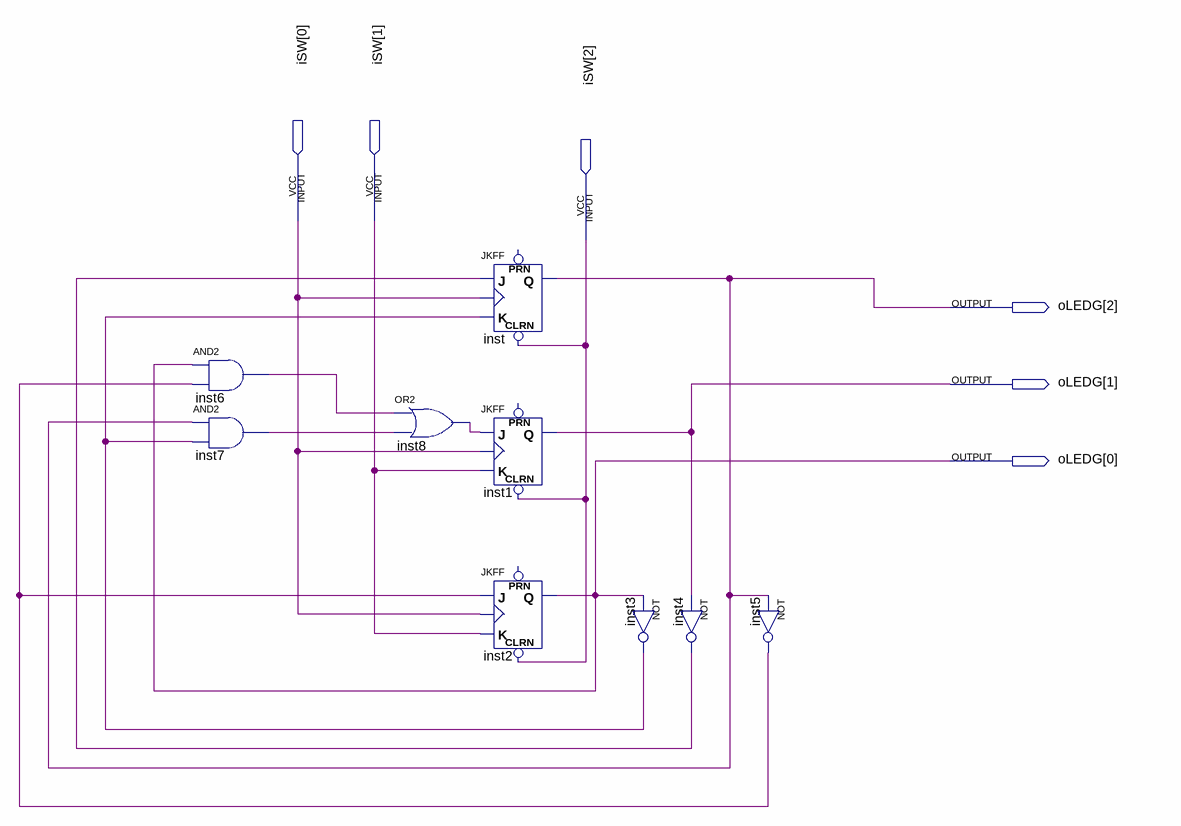
[diagram p0: schematic sheet]
// Quartus schematic Cwiczenie2_2.bdf as structural Verilog: 9 symbols, 6 pins
module Cwiczenie2_2 (
  input  [2:0] iSW,
  output [2:0] oLEDG
);

  wire inst3_out, inst4_out, inst5_out, inst6_out, inst7_out, inst8_out;

  and inst6 (inst6_out, oLEDG[0], inst5_out);
  and inst7 (inst7_out, oLEDG[2], inst3_out);
  or inst8 (inst8_out, inst6_out, inst7_out);
  JKFF inst (.CLRN(iSW[2]), .K(inst3_out), .J(inst4_out), .CLK(iSW[0]), .Q(oLEDG[2]));  // open: PRN
  JKFF inst1 (.CLRN(iSW[2]), .K(iSW[1]), .J(inst8_out), .CLK(iSW[0]), .Q(oLEDG[1]));  // open: PRN
  JKFF inst2 (.CLRN(iSW[2]), .K(iSW[1]), .J(inst5_out), .CLK(iSW[0]), .Q(oLEDG[0]));  // open: PRN
  not inst3 (inst3_out, oLEDG[0]);
  not inst4 (inst4_out, oLEDG[1]);
  not inst5 (inst5_out, oLEDG[2]);
endmodule
